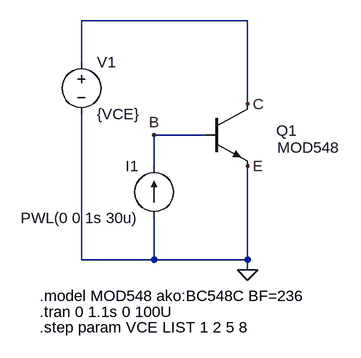
[diagram p0: schematic CircuitoCuartaParte.asc]
CircuitoCuartaParte.asc, the LTspice schematic file:
Version 4
SHEET 1 880 680
WIRE 256 48 0 48
WIRE 0 112 0 48
WIRE 256 176 256 48
WIRE 192 224 112 224
WIRE 112 272 112 224
WIRE 0 416 0 192
WIRE 112 416 112 352
WIRE 112 416 0 416
WIRE 256 416 256 272
WIRE 256 416 112 416
WIRE 256 432 256 416
FLAG 256 176 C
FLAG 112 224 B
FLAG 256 432 0
FLAG 256 272 E
SYMBOL npn 192 176 R0
WINDOW 0 108 41 Left 2
WINDOW 3 110 67 Left 2
SYMATTR InstName Q1
SYMATTR Value MOD548
SYMBOL voltage 0 96 R0
WINDOW 123 0 0 Left 0
WINDOW 39 0 0 Left 0
SYMATTR InstName V1
SYMATTR Value {VCE}
SYMBOL current 112 352 R180
WINDOW 0 24 80 Left 2
WINDOW 3 24 0 Left 2
WINDOW 123 0 0 Left 0
WINDOW 39 0 0 Left 0
SYMATTR InstName I1
SYMATTR Value PWL(0 0 1s 30u)
TEXT -64 472 Left 2 !.model MOD548 ako:BC548C BF=236
TEXT -64 496 Left 2 !.tran 0 1.1s 0 100U
TEXT -64 520 Left 2 !.step param VCE LIST 1 2 5 8

The netlist it stands for:
* CircuitoCuartaParte.asc
Q1 C B 0 0 MOD548
V1 C 0 {VCE}
I1 0 B PWL(0 0 1s 30u)
.model NPN NPN
.model PNP PNP
.lib standard.bjt
.model MOD548 ako:BC548C BF=236
.tran 0 1.1s 0 100U
.step param VCE LIST 1 2 5 8
.backanno
.end